# Altium project rgb_card.PrjPcb (part 1 of 4)
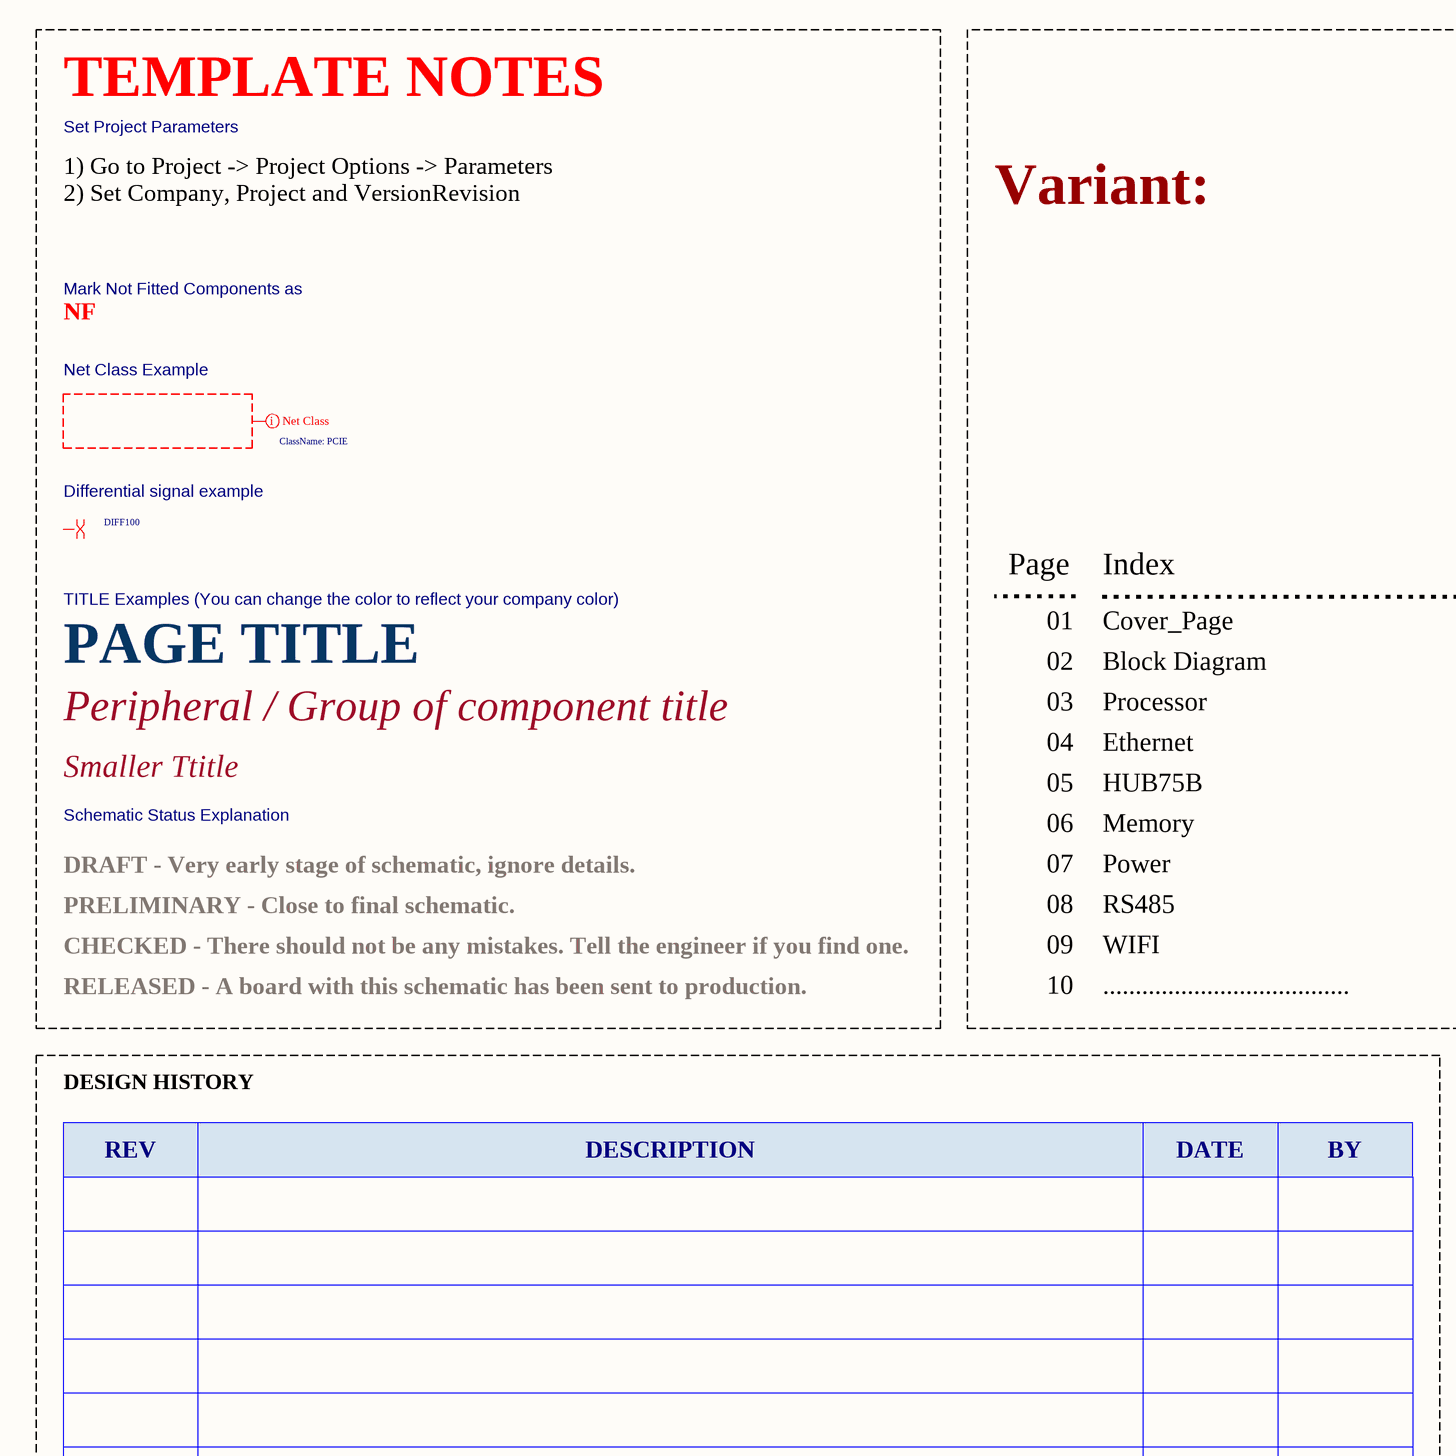
[diagram p0: Cover_Page.SchDoc, left]
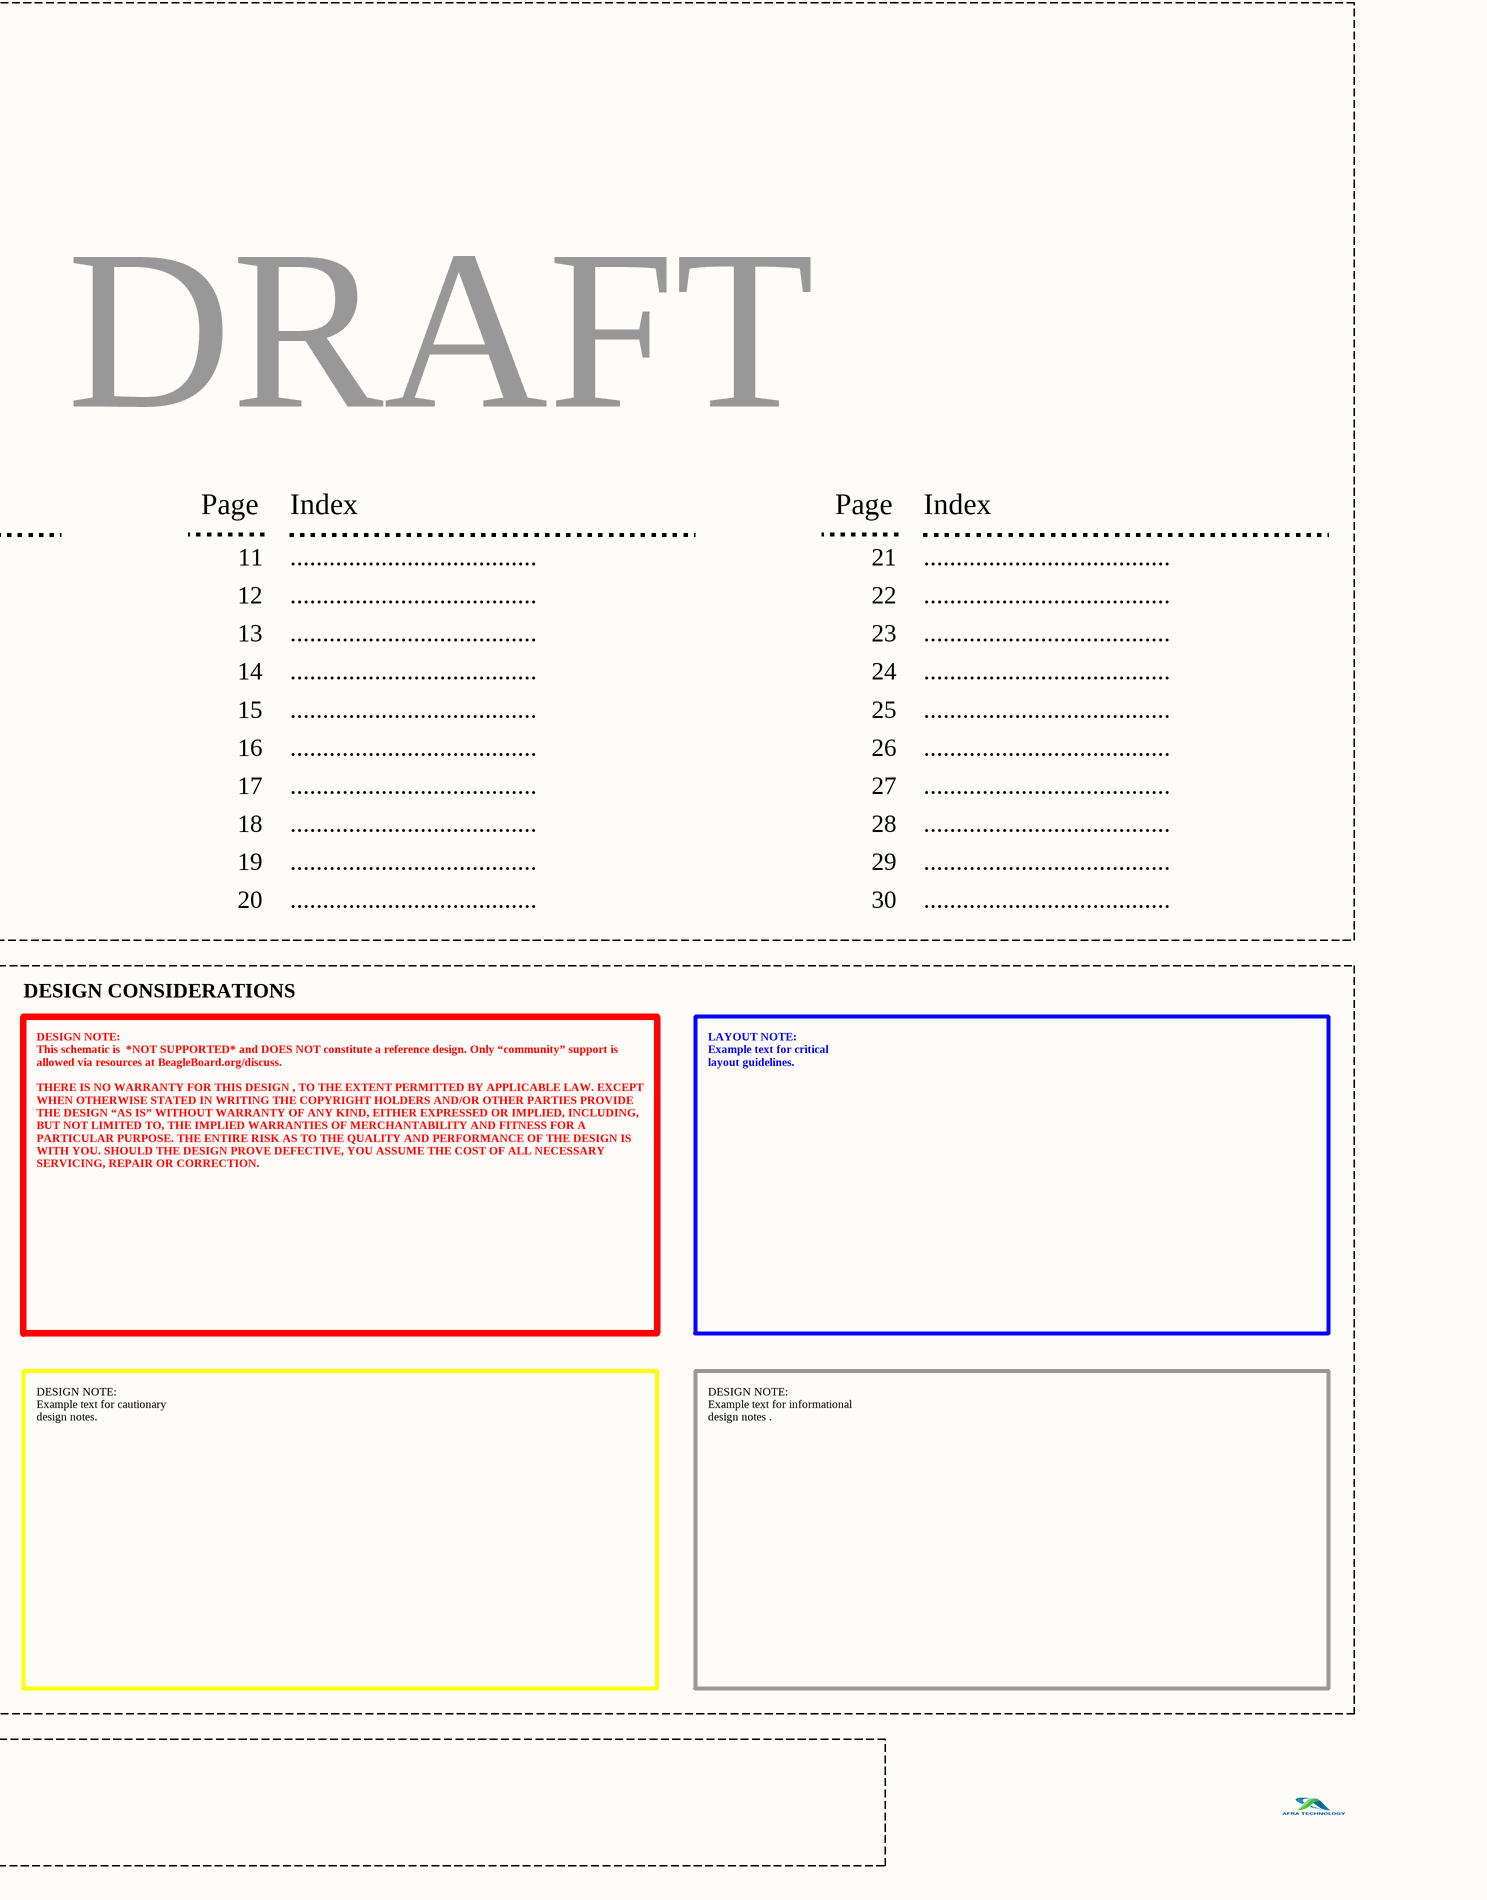
[diagram p1: Cover_Page.SchDoc, right]
Company: AFRA TECHNOLOGY; Project: RGB DMD Card; VersionRevision: v1.0.0
12 sheets, 273 parts. Net scope: hierarchical (ports join the sheet entries above them; power ports are global).
Board file: rgb_card.PcbDoc
Sheets:
  Cover_Page.SchDoc
  Block_Diagram.SchDoc
    U_rgb_card = rgb_card.SchDoc
    U_rs485 = rs485.SchDoc
    U_memory = memory.SchDoc
    U_wifi = wifi.SchDoc
    U_hub75d = hub75d.SchDoc
    U_power = power.SchDoc
    U_phy = phy.SchDoc
    U_rtc = rtc.SchDoc
    U_modem = modem.SchDoc
  ethernet.SchDoc

## Sheet Cover_Page.SchDoc
size A2; DrawnBy: Hanif; DocumentNumber: 202205001; SheetNumber: 1; SheetTotal: 9

### Layout directives
net class PCIE: (no net found under the mark)
differential pair; net class DIFF100: (no net found under the mark)

### Notes on the sheet
- Set Project Parameters
- TEMPLATE NOTES
- Variant:
- 1) Go to Project -> Project Options -> Parameters
  2) Set Company, Project and VersionRevision
- NF
- Mark Not Fitted Components as
- Net Class Example
- Differential signal example
- DRAFT
- TITLE Examples (You can change the color to reflect your company color)
- Page
- Index
- PAGE TITLE
- 01
- 02
- Cover_Page
- Block Diagram
- 11
- 12
- ......................................
- 21
- 22
- Peripheral / Group of component title
- 03
- 04
- Processor
- Ethernet
- 13
- 14
- 23
- 24
- Schematic Status Explanation
- Smaller Ttitle
- 05
- HUB75B
- 15
- 25
- DRAFT - Very early stage of schematic, ignore details.
- 06
- 07
- Memory
- Power
- 16
- 17
- 26
- 27
- PRELIMINARY - Close to final schematic.
- CHECKED - There should not be any mistakes. Tell the engineer if you find one.
- 08
- 09
- RS485
- WIFI
- 18
- 19
- 28
- 29
- RELEASED - A board with this schematic has been sent to production.
- 10
- 20
- 30
- DESIGN HISTORY
- DESIGN CONSIDERATIONS
- REV
- DESCRIPTION
- DATE
- BY
- DESIGN NOTE:
  This schematic is  *NOT SUPPORTED* and DOES NOT constitute a reference design. Only “community” support is allowed via resources at BeagleBoard.org/discuss.
  THERE IS NO WARRANTY FOR THIS DESIGN , TO THE EXTENT PERMITTED BY APPLICABLE LAW. EXCEPT WHEN OTHERWISE STATED IN WRITING THE COPYRIGHT HOLDERS AND/OR OTHER PARTIES PROVIDE THE DESIGN “AS IS” WITHOUT WARRANTY OF ANY KIND, EITHER EXPRESSED OR IMPLIED, INCLUDING, BUT NOT LIMITED TO, THE IMPLIED WARRANTIES OF MERCHANTABILITY AND FITNESS FOR A PARTICULAR PURPOSE. THE ENTIRE RISK AS TO THE QUALITY AND PERFORMANCE OF THE DESIGN IS WITH YOU. SHOULD THE DESIGN PROVE DEFECTIVE, YOU ASSUME THE COST OF ALL NECESSARY SERVICING, REPAIR OR CORRECTION.
- LAYOUT NOTE:
  Example text for critical
  layout guidelines.
- DESIGN NOTE:
  Example text for cautionary
  design notes.
- DESIGN NOTE:
  Example text for informational
  design notes .
- CONFIDENTAL. Do not distribute.
- Page Contents:
- Title:
- Company
- Logo
- Date:
- SIZE:
- A2
- DWG Num:
- Time:
- Sheet
- Revision:
- of
- Drawn by:
- Checked by:

## Sheet Block_Diagram.SchDoc
size A2; SheetNumber: 2; SheetTotal: 9
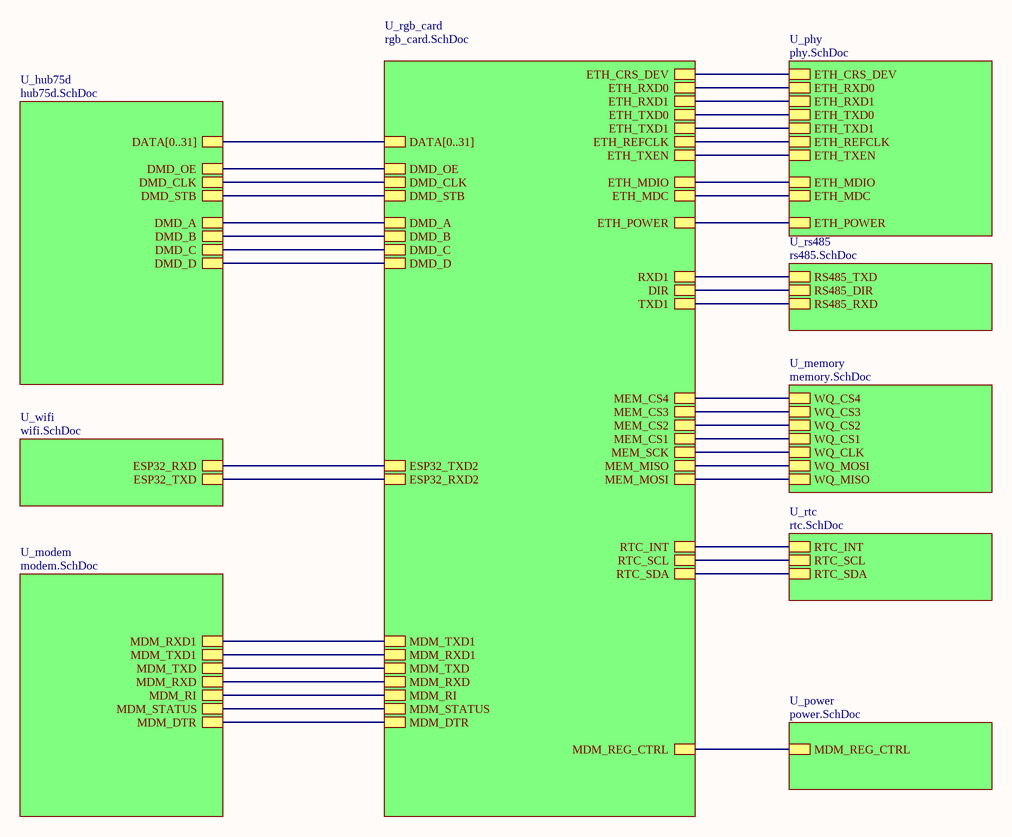
[diagram p2: Block_Diagram.SchDoc]

### Sub-sheets
U_hub75d = hub75d.SchDoc: DATA[0..31], DMD_OE, DMD_B, DMD_STB, DMD_D, DMD_C, DMD_CLK, DMD_A
U_memory = memory.SchDoc: WQ_CS1, WQ_MOSI, WQ_MISO, WQ_CLK, WQ_CS2, WQ_CS3, WQ_CS4
U_modem = modem.SchDoc: MDM_RXD, MDM_RXD1, MDM_RI, MDM_TXD, MDM_TXD1, MDM_STATUS, MDM_DTR
U_phy = phy.SchDoc: ETH_CRS_DEV, ETH_RXD0, ETH_RXD1, ETH_TXD0, ETH_TXD1, ETH_REFCLK, ETH_TXEN, ETH_MDIO, ETH_MDC, ETH_POWER
U_power = power.SchDoc: MDM_REG_CTRL
U_rgb_card = rgb_card.SchDoc: ESP32_TXD2, ESP32_RXD2, TXD1, RXD1, DIR, MEM_CS1, MEM_SCK, MEM_MISO, MEM_MOSI, DMD_D, DMD_OE, DMD_C, DMD_STB, DMD_B, DMD_CLK, DMD_A, DATA[0..31], MEM_CS3, MEM_CS2, MEM_CS4, ETH_TXD0, ETH_CRS_DEV, ETH_TXD1, ETH_REFCLK, ETH_RXD1, ETH_RXD0, ETH_TXEN, ETH_MDIO, ETH_MDC, ETH_POWER, RTC_SDA, RTC_SCL, RTC_INT, MDM_DTR, MDM_STATUS, MDM_TXD, MDM_TXD1, MDM_RXD, MDM_RXD1, MDM_RI, MDM_REG_CTRL
U_rs485 = rs485.SchDoc: RS485_TXD, RS485_DIR, RS485_RXD
U_rtc = rtc.SchDoc: RTC_INT, RTC_SCL, RTC_SDA
U_wifi = wifi.SchDoc: ESP32_RXD, ESP32_TXD

### Nets
DIR: sheet U_rgb_card/DIR, sheet U_rs485/RS485_DIR
DMD_A: sheet U_rgb_card/DMD_A, sheet U_hub75d/DMD_A
DMD_B: sheet U_rgb_card/DMD_B, sheet U_hub75d/DMD_B
DMD_C: sheet U_rgb_card/DMD_C, sheet U_hub75d/DMD_C
DMD_CLK: sheet U_rgb_card/DMD_CLK, sheet U_hub75d/DMD_CLK
DMD_D: sheet U_rgb_card/DMD_D, sheet U_hub75d/DMD_D
DMD_OE: sheet U_rgb_card/DMD_OE, sheet U_hub75d/DMD_OE
DMD_STB: sheet U_rgb_card/DMD_STB, sheet U_hub75d/DMD_STB
ESP32_RXD: sheet U_rgb_card/ESP32_TXD2, sheet U_wifi/ESP32_RXD
ESP32_TXD: sheet U_rgb_card/ESP32_RXD2, sheet U_wifi/ESP32_TXD
ETH_CRS_DEV: sheet U_rgb_card/ETH_CRS_DEV, sheet U_phy/ETH_CRS_DEV
ETH_MDC: sheet U_rgb_card/ETH_MDC, sheet U_phy/ETH_MDC
ETH_MDIO: sheet U_rgb_card/ETH_MDIO, sheet U_phy/ETH_MDIO
ETH_POWER: sheet U_rgb_card/ETH_POWER, sheet U_phy/ETH_POWER
ETH_REF_CLK: sheet U_rgb_card/ETH_REFCLK, sheet U_phy/ETH_REFCLK
ETH_RXD0: sheet U_rgb_card/ETH_RXD0, sheet U_phy/ETH_RXD0
ETH_RXD1: sheet U_rgb_card/ETH_RXD1, sheet U_phy/ETH_RXD1
ETH_TX_EN: sheet U_rgb_card/ETH_TXEN, sheet U_phy/ETH_TXEN
ETH_TXD0: sheet U_rgb_card/ETH_TXD0, sheet U_phy/ETH_TXD0
ETH_TXD1: sheet U_rgb_card/ETH_TXD1, sheet U_phy/ETH_TXD1
MDM_DTR: sheet U_rgb_card/MDM_DTR, sheet U_modem/MDM_DTR
MDM_REG_CTRL: sheet U_rgb_card/MDM_REG_CTRL, sheet U_power/MDM_REG_CTRL
MDM_RI: sheet U_rgb_card/MDM_RI, sheet U_modem/MDM_RI
MDM_RXD: sheet U_rgb_card/MDM_RXD, sheet U_modem/MDM_RXD
MDM_RXD1: sheet U_rgb_card/MDM_TXD1, sheet U_modem/MDM_RXD1
MDM_STATUS: sheet U_rgb_card/MDM_STATUS, sheet U_modem/MDM_STATUS
MDM_TXD: sheet U_rgb_card/MDM_TXD, sheet U_modem/MDM_TXD
MDM_TXD1: sheet U_rgb_card/MDM_RXD1, sheet U_modem/MDM_TXD1
MEM_CS1: sheet U_rgb_card/MEM_CS1, sheet U_memory/WQ_CS1
MEM_CS2: sheet U_rgb_card/MEM_CS2, sheet U_memory/WQ_CS2
MEM_CS3: sheet U_rgb_card/MEM_CS3, sheet U_memory/WQ_CS3
MEM_CS4: sheet U_rgb_card/MEM_CS4, sheet U_memory/WQ_CS4
MEM_MISO: sheet U_rgb_card/MEM_MISO, sheet U_memory/WQ_MOSI
MEM_MOSI: sheet U_rgb_card/MEM_MOSI, sheet U_memory/WQ_MISO
MEM_SCK: sheet U_rgb_card/MEM_SCK, sheet U_memory/WQ_CLK
RS485_RXD: sheet U_rgb_card/TXD1, sheet U_rs485/RS485_RXD
RS485_TXD: sheet U_rgb_card/RXD1, sheet U_rs485/RS485_TXD
RTC_INT: sheet U_rgb_card/RTC_INT, sheet U_rtc/RTC_INT
RTC_SCL: sheet U_rgb_card/RTC_SCL, sheet U_rtc/RTC_SCL
RTC_SDA: sheet U_rgb_card/RTC_SDA, sheet U_rtc/RTC_SDA

### Buses and harness runs
bus sheet U_hub75d/DATA[0..31] = sheet U_rgb_card/DATA[0..31]

### Notes on the sheet
- CONFIDENTAL. Do not distribute.
- Page Contents:
- Title:
- Company
- Logo
- Date:
- SIZE:
- A2
- DWG Num:
- Time:
- Variant:
- Sheet
- Revision:
- of
- Drawn by:
- Checked by:

## Sheet rgb_card.SchDoc
size A3
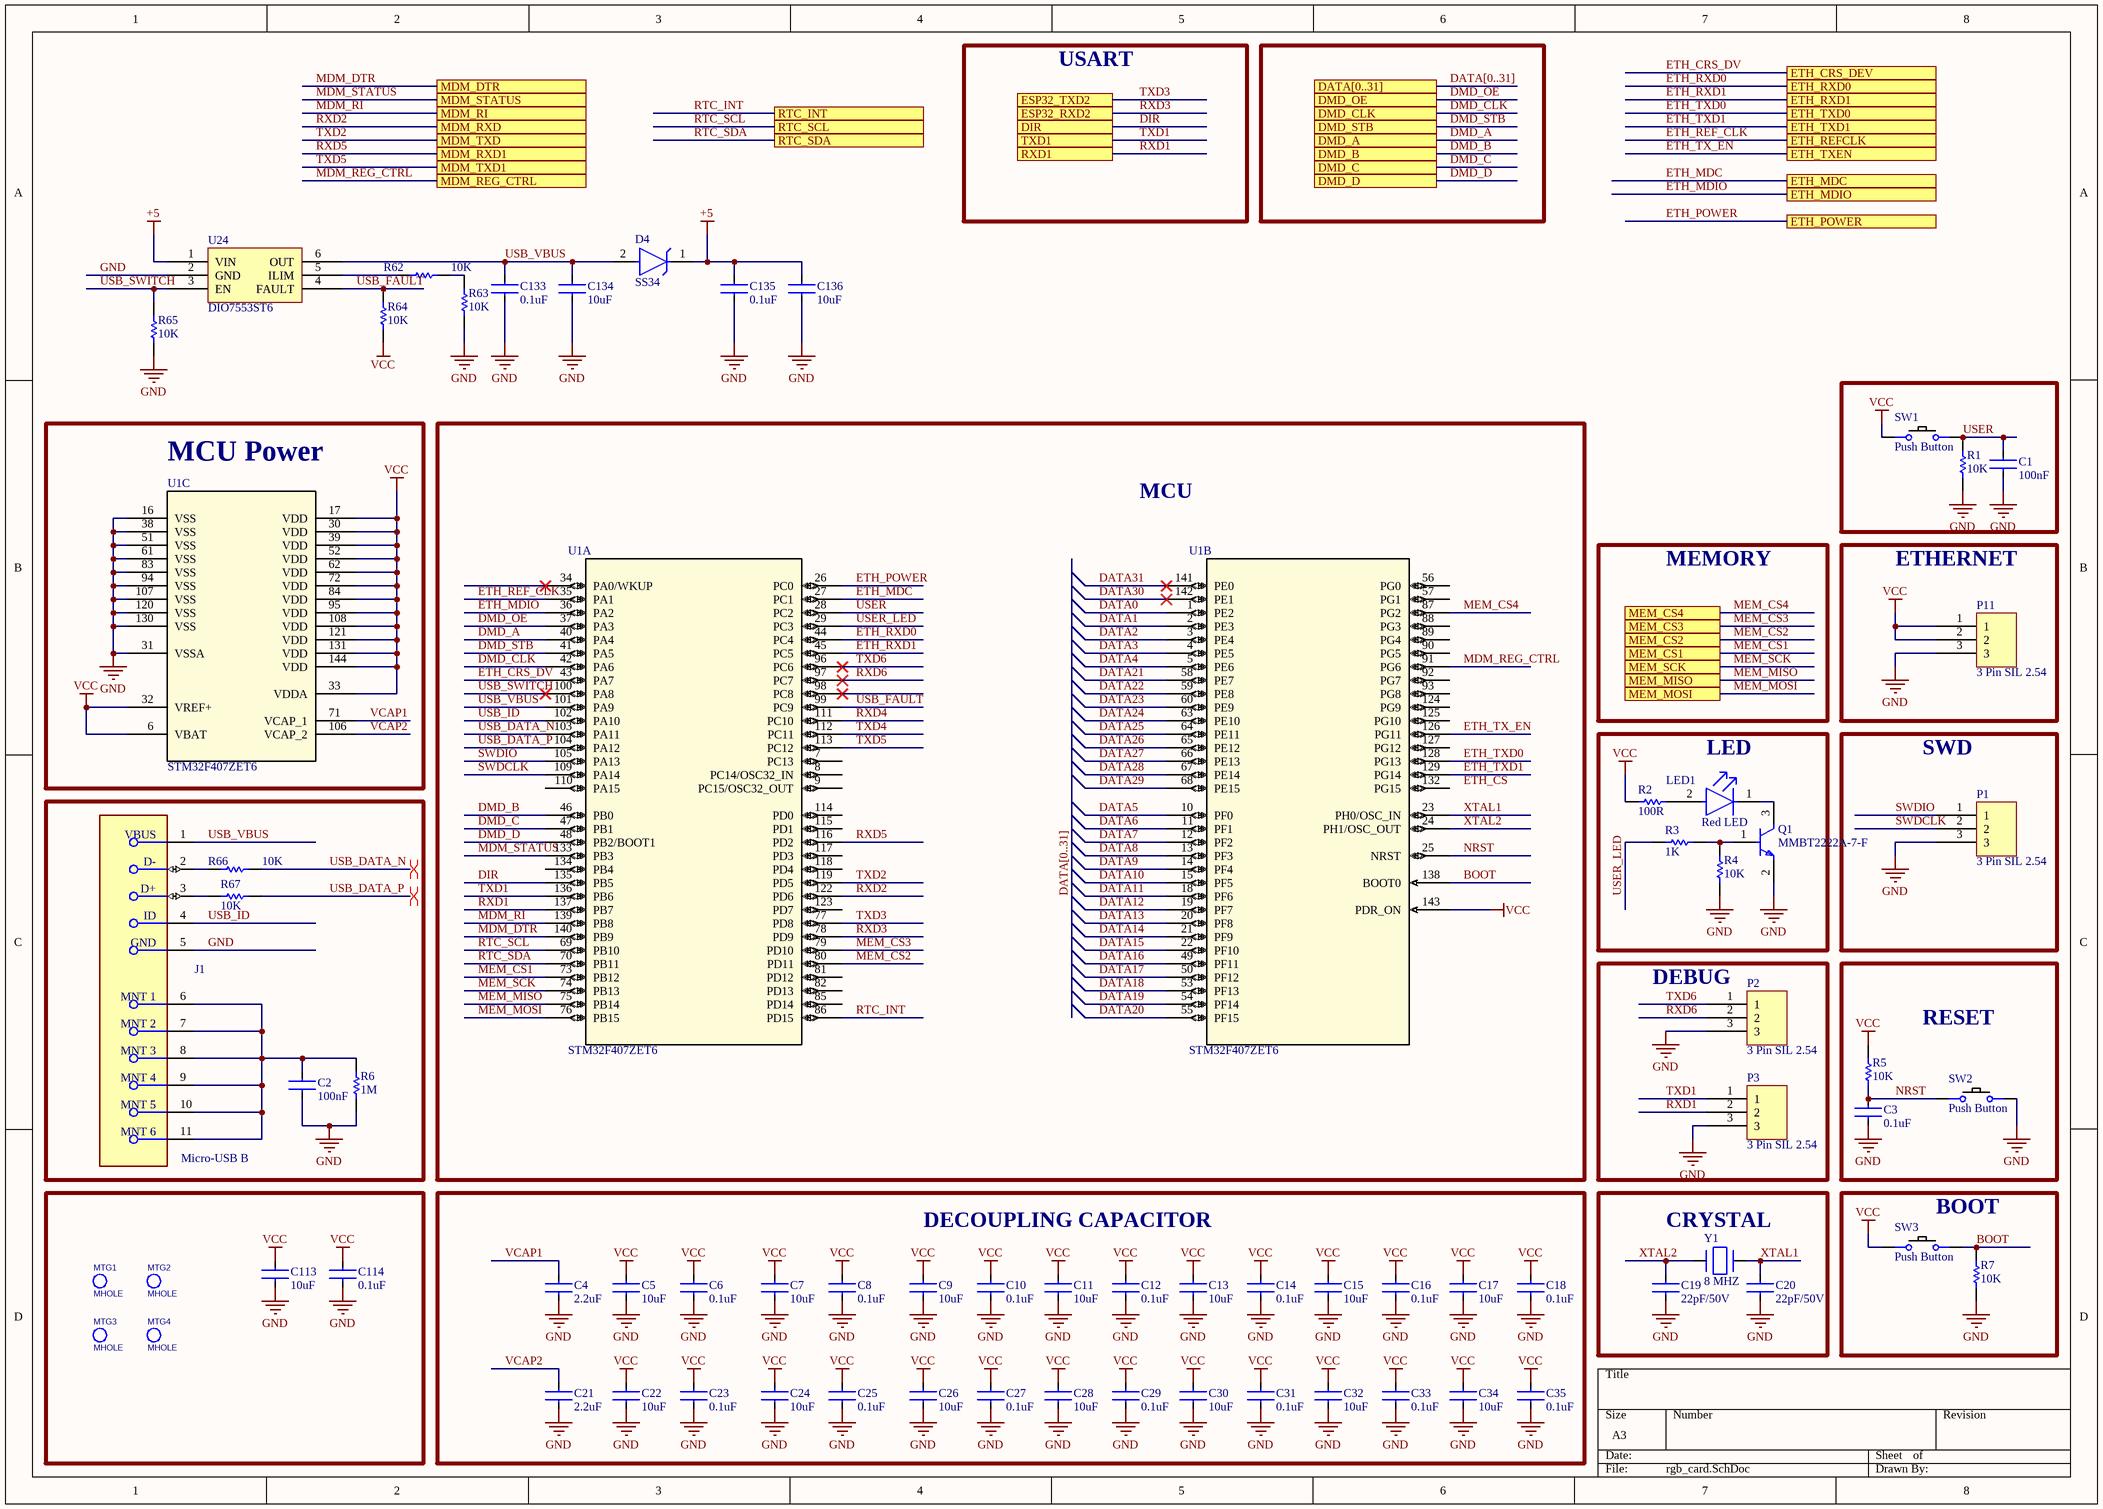
[diagram p3: rgb_card.SchDoc]

### Parts
C1  100nF  [C0402]
C2  100nF  [C0402]
C3  0.1uF  [C0402]
C4  2.2uF  [C0402]
C5  10uF  [C0402]
C6  0.1uF  [C0402]
C7  10uF  [C0402]
C8  0.1uF  [C0402]
C9  10uF  [C0402]
C10  0.1uF  [C0402]
C11  10uF  [C0402]
C12  0.1uF  [C0402]
C13  10uF  [C0402]
C14  0.1uF  [C0402]
C15  10uF  [C0402]
C16  0.1uF  [C0402]
C17  10uF  [C0402]
C18  0.1uF  [C0402]
C19  22pF/50V  [C0402]
C20  22pF/50V  [C0402]
C21  2.2uF  [C0402]
C22  10uF  [C0402]
C23  0.1uF  [C0402]
C24  10uF  [C0402]
C25  0.1uF  [C0402]
C26  10uF  [C0402]
C27  0.1uF  [C0402]
C28  10uF  [C0402]
C29  0.1uF  [C0402]
C30  10uF  [C0402]
C31  0.1uF  [C0402]
C32  10uF  [C0402]
C33  0.1uF  [C0402]
C34  10uF  [C0402]
C35  0.1uF  [C0402]
C113  10uF  [C0402]
C114  0.1uF  [C0402]
C133  0.1uF  [C0402]
C134  10uF  [C0402]
C135  0.1uF  [C0402]
C136  10uF  [C0402]
D4  SS34  [SMA (DO-214AC)]
J1  Micro-USB B  [Micro_USB_47346- 1001]
LED1  Red LED  [SMD_LED_1206]
MTG1  MHOLE  [MHOLE]  (no BOM)
MTG2  MHOLE  [MHOLE]  (no BOM)
MTG3  MHOLE  [MHOLE]  (no BOM)
MTG4  MHOLE  [MHOLE]  (no BOM)
P1  3 Pin SIL 2.54  [3 Pin SIL 2.54]
P2  3 Pin SIL 2.54  [3 Pin SIL 2.54]
P3  3 Pin SIL 2.54  [3 Pin SIL 2.54]
P11  3 Pin SIL 2.54  [3 Pin SIL 2.54]
Q1  MMBT2222A-7-F  [SOT-23-3L_AOS]
R1  10K  [R0402]
R2  100R  [R0402]
R3  1K  [R0402]
R4  10K  [R0402]
R5  10K  [R0402]
R6  1M  [R0402]
R7  10K  [R0402]
R62  10K  [R0402]
R63  10K  [R0402]
R64  10K  [R0402]
R65  10K  [R0402]
R66  10K  [R0402]
R67  10K  [R0402]
SW1  Push Button  [Tactile Switch SPST]
SW2  Push Button  [Tactile Switch SPST]
SW3  Push Button  [Tactile Switch SPST]
U1  STM32F407ZET6  [LQFP144-20x20mm]  (parts A,B,C of 3)
U24  DIO7553ST6  [SOT23-6]
Y1  8 MHZ  [CTS_ATS080B_0]

### Blocks framed on the sheet
MCU Power: U1
MCU: U1
ETHERNET: P11
LED: LED1 Q1 R2-R4
SWD: P1
DEBUG: P2 P3
RESET: C3 R5 SW2
DECOUPLING CAPACITOR: C4-C18 C21-C35
CRYSTAL: C19 C20 Y1
BOOT: R7 SW3

### Ports
DATA[0..31], DIR, DMD_A, DMD_B, DMD_C, DMD_CLK, DMD_D, DMD_OE, DMD_STB, ESP32_RXD2, ESP32_TXD2, ETH_CRS_DEV, ETH_MDC, ETH_MDIO, ETH_POWER, ETH_REFCLK, ETH_RXD0, ETH_RXD1, ETH_TXD0, ETH_TXD1, ETH_TXEN, MDM_DTR, MDM_REG_CTRL, MDM_RI, MDM_RXD, MDM_RXD1, MDM_STATUS, MDM_TXD, MDM_TXD1, MEM_CS1, MEM_CS2, MEM_CS3, MEM_CS4, MEM_MISO, MEM_MOSI, MEM_SCK, RTC_INT, RTC_SCL, RTC_SDA, RXD1, TXD1

### Nets
+5: C135.1 C136.1 D4.1(C) U24.1(VIN)
GND: C1.2 C2.2 C3.2 C4.2 C5.2 C6.2 C7.2 C8.2 C9.2 C10.2 C11.2 C12.2 C13.2 C14.2 C15.2 C16.2 C17.2 C18.2 C19.2 C20.2 C21.2 C22.2 C23.2 C24.2 C25.2 C26.2 C27.2 C28.2 C29.2 C30.2 C31.2 C32.2 C33.2 C34.2 C35.2 C113.2 C114.2 C133.2 C134.2 C135.2 C136.2 J1.5(GND) P1.3 P2.3 P3.3 P11.3 Q1.2(E) R1.1 R4.1 R6.1 R7.1 R63.1 R65.1 SW2.3,4 U1.16(VSS) U1.31(VSSA) U1.38(VSS) U1.51(VSS) U1.61(VSS) U1.83(VSS) U1.94(VSS) U1.107(VSS) U1.120(VSS) U1.130(VSS) U24.2(GND)
VCC: C5.1 C6.1 C7.1 C8.1 C9.1 C10.1 C11.1 C12.1 C13.1 C14.1 C15.1 C16.1 C17.1 C18.1 C22.1 C23.1 C24.1 C25.1 C26.1 C27.1 C28.1 C29.1 C30.1 C31.1 C32.1 C33.1 C34.1 C35.1 C113.1 C114.1 P11.1 P11.2 R2.1 R5.2 R64.1 SW1.1,2 SW3.1,2 U1.6(VBAT) U1.17(VDD) U1.30(VDD) U1.32(VREF+) U1.33(VDDA) U1.39(VDD) U1.52(VDD) U1.62(VDD) U1.72(VDD) U1.84(VDD) U1.95(VDD) U1.108(VDD) U1.121(VDD) U1.131(VDD) U1.143(PDR_ON) U1.144(VDD)
BOOT: R7.2 SW3.3,4 U1.138(BOOT0)
DATA0: U1.1(PE2)
DATA1: U1.2(PE3)
DATA2: U1.3(PE4)
DATA3: U1.4(PE5)
DATA4: U1.5(PE6)
DATA5: U1.10(PF0)
DATA6: U1.11(PF1)
DATA7: U1.12(PF2)
DATA8: U1.13(PF3)
DATA9: U1.14(PF4)
DATA10: U1.15(PF5)
DATA11: U1.18(PF6)
DATA12: U1.19(PF7)
DATA13: U1.20(PF8)
DATA14: U1.21(PF9)
DATA15: U1.22(PF10)
DATA16: U1.49(PF11)
DATA17: U1.50(PF12)
DATA18: U1.53(PF13)
DATA19: U1.54(PF14)
DATA20: U1.55(PF15)
DATA21: U1.58(PE7)
DATA22: U1.59(PE8)
DATA23: U1.60(PE9)
DATA24: U1.63(PE10)
DATA25: U1.64(PE11)
DATA26: U1.65(PE12)
DATA27: U1.66(PE13)
DATA28: U1.67(PE14)
DATA29: U1.68(PE15)
DATA30: U1.142(PE1)
DATA31: U1.141(PE0)
DIR: U1.135(PB5) ; port DIR
DMD_A: U1.40(PA4) ; port DMD_A
DMD_B: U1.46(PB0) ; port DMD_B
DMD_C: U1.47(PB1) ; port DMD_C
DMD_CLK: U1.42(PA6) ; port DMD_CLK
DMD_D: U1.48(PB2/BOOT1) ; port DMD_D
DMD_OE: U1.37(PA3) ; port DMD_OE
DMD_STB: U1.41(PA5) ; port DMD_STB
ETH_CRS_DV: U1.43(PA7) ; port ETH_CRS_DEV  [project net ETH_CRS_DEV]
ETH_MDC: U1.27(PC1) ; port ETH_MDC
ETH_MDIO: U1.36(PA2) ; port ETH_MDIO
ETH_POWER: U1.26(PC0) ; port ETH_POWER
ETH_REF_CLK: U1.35(PA1) ; port ETH_REFCLK
ETH_RXD0: U1.44(PC4) ; port ETH_RXD0
ETH_RXD1: U1.45(PC5) ; port ETH_RXD1
ETH_TX_EN: U1.126(PG11) ; port ETH_TXEN
ETH_TXD0: U1.128(PG13) ; port ETH_TXD0
ETH_TXD1: U1.129(PG14) ; port ETH_TXD1
MDM_DTR: U1.140(PB9) ; port MDM_DTR
MDM_REG_CTRL: U1.91(PG6) ; port MDM_REG_CTRL
MDM_RI: U1.139(PB8) ; port MDM_RI
MDM_STATUS: U1.133(PB3) ; port MDM_STATUS
MEM_CS1: U1.73(PB12) ; port MEM_CS1
MEM_CS2: U1.80(PD11) ; port MEM_CS2
MEM_CS3: U1.79(PD10) ; port MEM_CS3
MEM_CS4: U1.87(PG2) ; port MEM_CS4
MEM_MISO: U1.75(PB14) ; port MEM_MISO
MEM_MOSI: U1.76(PB15) ; port MEM_MOSI
MEM_SCK: U1.74(PB13) ; port MEM_SCK
NRST: C3.1 R5.1 SW2.1,2 U1.25(NRST)
RTC_INT: U1.86(PD15) ; port RTC_INT
RTC_SCL: U1.69(PB10) ; port RTC_SCL
RTC_SDA: U1.70(PB11) ; port RTC_SDA
RXD1: P3.2 U1.137(PB7) ; port RXD1  [project net RS485_TXD]
RXD2: U1.122(PD6) ; port MDM_RXD  [project net MDM_RXD]
RXD3: U1.78(PD9) ; port ESP32_RXD2  [project net ESP32_TXD]
RXD4: U1.111(PC10)
RXD5: U1.116(PD2) ; port MDM_RXD1  [project net MDM_TXD1]
RXD6: P2.2 U1.97(PC7)
SWDCLK: P1.2 U1.109(PA14)
SWDIO: P1.1 U1.105(PA13)
TXD1: P3.1 U1.136(PB6) ; port TXD1  [project net RS485_RXD]
TXD2: U1.119(PD5) ; port MDM_TXD  [project net MDM_TXD]
TXD3: U1.77(PD8) ; port ESP32_TXD2  [project net ESP32_RXD]
TXD4: U1.112(PC11)
TXD5: U1.113(PC12) ; port MDM_TXD1  [project net MDM_RXD1]
TXD6: P2.1 U1.96(PC6)
USB_DATA_N: R66.2 U1.103(PA11)
USB_DATA_P: R67.2 U1.104(PA12)
USB_FAULT: R64.2 U1.99(PC9) U24.4(FAULT)
USB_ID: J1.4(ID) U1.102(PA10)
USB_SWITCH: R65.2 U1.100(PA8) U24.3(EN)
USB_VBUS: C133.1 C134.1 D4.2(A) J1.1(VBUS) U1.101(PA9) U24.6(OUT)
USER: C1.1 R1.2 SW1.3,4 U1.28(PC2)
USER_LED: R3.1 U1.29(PC3)
VCAP1: C4.1 U1.71(VCAP_1)
VCAP2: C21.1 U1.106(VCAP_2)
XTAL1: C20.1 U1.23(PH0/OSC_IN) Y1.2
XTAL2: C19.1 U1.24(PH1/OSC_OUT) Y1.1
NetC2_1: C2.1 J1.6(MNT_1) J1.7(MNT_2) J1.8(MNT_3) J1.9(MNT_4) J1.10(MNT_5) J1.11(MNT_6) R6.2
NetJ1_2: J1.2(D-) R66.1
NetJ1_3: J1.3(D+) R67.1
NetLED1_1: LED1.1(C) Q1.3(C)
NetLED1_2: LED1.2(A) R2.2
NetQ1_1: Q1.1(B) R3.2 R4.2
NetR62_1: R62.1 U24.5(ILIM)
NetR62_2: R62.2 R63.2

Not connected (* = marked no-connect by the designer): MTG1 1(TP); MTG2 1(TP); MTG3 1(TP); MTG4 1(TP); U1 7(PC13) 8(PC14/OSC32_IN) 9(PC15/OSC32_OUT) 34(PA0/WKUP)* 56(PG0) 57(PG1) 81(PD12) 82(PD13) 85(PD14) 88(PG3) 89(PG4) 90(PG5) 92(PG7) 93(PG8) 98(PC8)* 110(PA15) 114(PD0) 115(PD1) 117(PD3) 118(PD4) 123(PD7) 124(PG9) 125(PG10) 127(PG12) 132(PG15) 134(PB4)

### Buses and harness runs
bus DATA[0..31]
bus DATA[0..31] = port DATA[0..31]

### Layout directives
differential pair: USB_DATA_N, USB_DATA_P

### Notes on the sheet
- USART
- MEMORY
- Labels drawn without touching a wire or pin: ETH_CS

### Library data of the parts
C1 C2 = CL31B104KBCNFNC: CAP CER 0.1UF 50V X7R 1206, ±10% 50V Ceramic Capacitor X7R 1206 (3216 Metric); Supplier 1: Digi-Key; Supplier Part Number 1: 1276-2744-1-ND
C3 C6 C8 C10 C12 C14 C16 C18 C23 C25 C27 C29 C31 C33 C35 C114 C133 C135 = CL31B104KBCNNNC: Ceramic capacitor SMD-1206 100nF /50V X7R# K +-10%, Samsung, RoHS; Tolerance: 10%; Dielectric: X7R; Voltage: 50V; Supplier 1: Arrow Electronics; Manufacturer: Samsung; Manufacturer Part Number: CL31B104KBCNNNC; RoHS: Yes; Category: Ceramic Capacitors; Stock 1: 3508000; Pricing 1: 4000=0.02060, 8000=0.01660 (USD); Mount: Surface Mount; Case/Package: 1206; Case Code (Metric): 3216; Case Code (Imperial): 1206; Material: Ceramic; Contact Plating: Tin; Min Operating Temperature: -55°C; Max Operating Temperature: 125°C; Capacitance: 100nF; Voltage Rating (DC): 50V; Packaging: Tape and Reel; Voltage Rating: 50V; Series: CL; Length: 3.2mm; Width: 0.063inch; Height: 0.85mm; Depth: 1.6mm; Thickness: 0.037inch; Radiation Hardening: No; Lead Free: Lead Free; RoHS Compliant: Yes; ComponentLink1URL: https://datasheet.ciiva.com/25710/cl31b104kbcnnnc-25710293.pdf?src-supplier=Digi-Key; ComponentLink1Description: https://datasheet.ciiva.com/25710/cl31b104kbcnnnc-25710293.pdf?src-supplier=Digi-Key; ComponentLink2URL: https://datasheet.ciiva.com/29201/451941-da-01-en-vs-kondensator-1206-29201689.pdf?src-supplier=Conrad; ComponentLink2Description: https://datasheet.ciiva.com/29201/451941-da-01-en-vs-kondensator-1206-29201689.pdf?src-supplier=Conrad; ComponentLink3URL: https://datasheet.ciiva.com/16298/cl05b104kq5nnnc-16298186.pdf?src-supplier=Future+Electronics; ComponentLink3Description: https://datasheet.ciiva.com/16298/cl05b104kq5nnnc-16298186.pdf?src-supplier=Future+Electronics; Supplier Part Number 1: CL31B104KBCNNNC
C4 C21 = CL31B225KBHNNNE: Cap Ceramic 2.2uF 50V C0G 5% SMD 1206 125°C Paper T/R; Manufacturer: Samsung; Manufacturer Part Number: CL31C220JBCNNNC; Capacitance: 22pF; Temperature Coefficient: 300ppm/°C; Supplier 1: Arrow Electronics; RoHS: Yes; Category: Ceramic Capacitors; Stock 1: 470; Pricing 1: 1=0.13340, 10=0.08580, 25=0.08490, 100=0.04720, 250=0.04670 (USD); Mount: Surface Mount; Case/Package: 1206; Case Code (Metric): 3216; Case Code (Imperial): 1206; Material: Ceramic; Min Operating Temperature: -55°C; Max Operating Temperature: 125°C; Tolerance: 5%; Dielectric: C0G; Voltage Rating: 50V; Package Quantity: 1; Packaging: Tape and Reel; Voltage: 50V; Voltage Rating (DC): 50V; Series: CL; Construction: Flat; Length: 3.2mm; Width: 0.063inch; Height: 0.85mm; Depth: 1.6mm; Thickness: 0.039inch; Radiation Hardening: No; Lead Free: Lead Free; RoHS Compliant: Yes; ComponentLink1URL: https://datasheet.ciiva.com/25799/cl31c220jbcnnnc-25799089.pdf?src-supplier=Digi-Key; ComponentLink1Description: https://datasheet.ciiva.com/25799/cl31c220jbcnnnc-25799089.pdf?src-supplier=Digi-Key; ComponentLink2URL: https://datasheet.ciiva.com/29201/452314-da-01-en-vs-kondensator-1206-29201377.pdf?src-supplier=Conrad; ComponentLink2Description: https://datasheet.ciiva.com/29201/452314-da-01-en-vs-kondensator-1206-29201377.pdf?src-supplier=Conrad; Supplier Part Number 1: CL31C220JBCNNNC
C5 C7 C9 C11 C13 C15 C17 C22 C24 C26 C28 C30 C32 C34 C113 C134 C136 = CL31B106KOHNNNE: Cap Ceramic 10uF 16V X7R 10% Pad SMD 1206 125°C T/R; Manufacturer: Samsung; Supplier 1: Future Electronics; Manufacturer Part Number: CL31B106KOHNNNE; RoHS: Yes; Category: Ceramic Capacitors; Stock 1: 116000; Pricing 1: 2000=0.03800, 6000=0.03460, 8000=0.03450, 20000=0.03420, 30000=0.03400 (USD); Mount: Surface Mount; Case/Package: 1206; Case Code (Metric): 3216; Case Code (Imperial): 1206; Material: Ceramic; Contact Plating: Tin; Min Operating Temperature: -55°C; Max Operating Temperature: 125°C; Capacitance: 10uF; Tolerance: 10%; Dielectric: X7R; Package Quantity: 1; Packaging: Tape and Reel; Voltage Rating: 16V; Series: CL; Length: 3.2mm; Width: 0.063inch; Height: 1.6mm; Thickness: 0.071inch; Depth: 1.6mm; RoHS Compliant: Yes; ComponentLink1URL: https://datasheet.ciiva.com/25795/cl31b106kohnnne-25795201.pdf?src-supplier=Digi-Key; ComponentLink1Description: https://datasheet.ciiva.com/25795/cl31b106kohnnne-25795201.pdf?src-supplier=Digi-Key; ComponentLink2URL: https://datasheet.ciiva.com/29201/452535-da-01-en-vs-kondensator-1206-29201132.pdf?src-supplier=Conrad; ComponentLink2Description: https://datasheet.ciiva.com/29201/452535-da-01-en-vs-kondensator-1206-29201132.pdf?src-supplier=Conrad; Supplier Part Number 1: 2558872
C19 C20 = CL31C220JBCNNNC: Cap Ceramic 22pF 50V C0G 5% SMD 1206 125°C Paper T/R; Manufacturer: Samsung; Temperature Coefficient: 300ppm/°C; Supplier 1: Arrow Electronics; Manufacturer Part Number: CL31C220JBCNNNC; RoHS: Yes; Category: Ceramic Capacitors; Stock 1: 470; Pricing 1: 1=0.13340, 10=0.08580, 25=0.08490, 100=0.04720, 250=0.04670 (USD); Mount: Surface Mount; Case/Package: 1206; Case Code (Metric): 3216; Case Code (Imperial): 1206; Material: Ceramic; Min Operating Temperature: -55°C; Max Operating Temperature: 125°C; Capacitance: 22pF; Tolerance: 5%; Dielectric: C0G; Voltage Rating: 50V; Package Quantity: 1; Packaging: Tape and Reel; Voltage: 50V; Voltage Rating (DC): 50V; Series: CL; Construction: Flat; Length: 3.2mm; Width: 0.063inch; Height: 0.85mm; Depth: 1.6mm; Thickness: 0.039inch; Radiation Hardening: No; Lead Free: Lead Free; RoHS Compliant: Yes; ComponentLink1URL: https://datasheet.ciiva.com/25799/cl31c220jbcnnnc-25799089.pdf?src-supplier=Digi-Key; ComponentLink1Description: https://datasheet.ciiva.com/25799/cl31c220jbcnnnc-25799089.pdf?src-supplier=Digi-Key; ComponentLink2URL: https://datasheet.ciiva.com/29201/452314-da-01-en-vs-kondensator-1206-29201377.pdf?src-supplier=Conrad; ComponentLink2Description: https://datasheet.ciiva.com/29201/452314-da-01-en-vs-kondensator-1206-29201377.pdf?src-supplier=Conrad; Supplier Part Number 1: CL31C220JBCNNNC
D4 = SS34: DIODE SCHOTTKY 40V 3A SMC; Supplier 1: Newark; Supplier Part Number 1: 05R5898
J1 = 47346-0001: Micro-USB B Receptacle with Flange, Bottom Mount, Surface Mount, Lead-Free; Manufacturer: Molex; Supplier 1: Arrow Electronics; Manufacturer Part Number: 47346-0001; RoHS: Yes; Category: Headers and Wire Housings; Stock 1: 5771; Pricing 1: 1=1.09160, 10=0.90940, 25=0.90030, 100=0.76040, 250=0.75290, 500=0.74530, 1000=0.57460, 3000=0.56860, 6000=0.56250 (USD); ComponentLink1URL: https://datasheet.ciiva.com/30075/304740473460001-io-nectors-30075527.pdf?src-supplier=Onlinecomponents.com; ComponentLink1Description: https://datasheet.ciiva.com/30075/304740473460001-io-nectors-30075527.pdf?src-supplier=Onlinecomponents.com; ComponentLink2URL: https://datasheet.ciiva.com/16148/1700180473460001-io-nectors-16148917.pdf?src-supplier=Onlinecomponents.com; ComponentLink2Description: https://datasheet.ciiva.com/16148/1700180473460001-io-nectors-16148917.pdf?src-supplier=Onlinecomponents.com; ComponentLink3URL: https://datasheet.ciiva.com/22654/1630785-22654942.pdf?src-supplier=Element14; ComponentLink3Description: https://datasheet.ciiva.com/22654/1630785-22654942.pdf?src-supplier=Element14; ComponentLink4URL: https://datasheet.ciiva.com/4598/0473460001-io-connectors-146446-4598841.pdf?src-supplier=Mouser; ComponentLink4Description: https://datasheet.ciiva.com/4598/0473460001-io-connectors-146446-4598841.pdf?src-supplier=Mouser; ComponentLink5URL: https://datasheet.ciiva.com/1098/1698067-1098476.pdf?src-supplier=Element14; ComponentLink5Description: https://datasheet.ciiva.com/1098/1698067-1098476.pdf?src-supplier=Element14; ComponentLink6URL: https://datasheet.ciiva.com/11731/0900766b80dfe0a7-11731298.pdf?src-supplier=RSComponents; ComponentLink6Description: https://datasheet.ciiva.com/11731/0900766b80dfe0a7-11731298.pdf?src-supplier=RSComponents; ComponentLink7URL: https://datasheet.ciiva.com/16986/70266948-16986683.pdf?src-supplier=Allied+Electronics; ComponentLink7Description: https://datasheet.ciiva.com/16986/70266948-16986683.pdf?src-supplier=Allied+Electronics; ComponentLink8URL: https://datasheet.ciiva.com/28504/0473460001-io-connectors-28504587.pdf?src-supplier=Element14; ComponentLink8Description: https://datasheet.ciiva.com/28504/0473460001-io-connectors-28504587.pdf?src-supplier=Element14; ComponentLink9URL: https://datasheet.ciiva.com/46390/1681853-46390956.pdf?src-supplier=Element14; ComponentLink9Description: https://datasheet.ciiva.com/46390/1681853-46390956.pdf?src-supplier=Element14; Supplier Part Number 1: 47346-0001
LED1 = LTST-C150CKT: Red 3.2 x 1.6 x 1.1 mm 130° Water Clear 10 mcd 1.8 V Chip LED Surface Mount; Manufacturer: Vishay Lite-On; Lens Color: Colorless; Lens Style: Diffused,Colorless,Clear,Rectangular; Dominant Wavelength: 638nm; Number of LEDs: 1; Forward Current: 40mA; Forward Voltage: 1.8V; Power Rating: 100mW; Luminous Intensity: 25mcd; Test Current: 10mA; Wavelength: 660nm; Reverse Voltage: 5V; Supplier 1: IBE SMT Equipment; Manufacturer Part Number: LTST-C150CKT; RoHS: Yes; Category: LEDs; Stock 1: 5225; Pricing 1: 5225=0.05000 (USD); Mount: Surface Mount; Case/Package: 1206; Number of Pins: 2; Color: Red; Case Code (Metric): 3216; Case Code (Imperial): 1206; Min Operating Temperature: -55°C; Max Operating Temperature: 85°C; Viewing Angle: 130°; Packaging: Tape and Reel; Package Quantity: 1; Illumination Color: Red; Lens Transparency: Clear; Number of Elements: 1; Power Dissipation: 100mW; Series: CHIPLED 1206; Max Power Dissipation: 100mW; Length: 3.2mm; Width: 1.6mm; Height: 1.1mm; Depth: 1.6mm; Radiation Hardening: No; Lead Free: Lead Free; RoHS Compliant: Yes; ComponentLink1URL: https://datasheet.ciiva.com/2110/ltst-c150ckt-2110225.pdf?src-supplier=Digi-Key; ComponentLink1Description: https://datasheet.ciiva.com/2110/ltst-c150ckt-2110225.pdf?src-supplier=Digi-Key; ComponentLink2URL: https://datasheet.ciiva.com/11775/0900766b80dc025c-11775635.pdf?src-supplier=RSComponents; ComponentLink2Description: https://datasheet.ciiva.com/11775/0900766b80dc025c-11775635.pdf?src-supplier=RSComponents; ComponentLink3URL: https://datasheet.ciiva.com/19465/697733-19465844.pdf?src-supplier=Jameco; ComponentLink3Description: https://datasheet.ciiva.com/19465/697733-19465844.pdf?src-supplier=Jameco; ComponentLink4URL: https://datasheet.ciiva.com/16222/lite-on20ltst-c150ckt-16222610.pdf?src-supplier=Future+Electronics; ComponentLink4Description: https://datasheet.ciiva.com/16222/lite-on20ltst-c150ckt-16222610.pdf?src-supplier=Future+Electronics; ComponentLink5URL: https://datasheet.ciiva.com/15117/getdatasheetpartid-103928-15117444.pdf?src-supplier=Verical; ComponentLink5Description: https://datasheet.ciiva.com/15117/getdatasheetpartid-103928-15117444.pdf?src-supplier=Verical; ComponentLink6URL: https://datasheet.ciiva.com/2110/s-110-ltst-c150ckt-2110226.pdf?src-supplier=Digi-Key; ComponentLink6Description: https://datasheet.ciiva.com/2110/s-110-ltst-c150ckt-2110226.pdf?src-supplier=Digi-Key; ComponentLink7URL: https://datasheet.ciiva.com/2110/s-110-ltst-c150ckt-2110227.pdf?src-supplier=Digi-Key; ComponentLink7Description: https://datasheet.ciiva.com/2110/s-110-ltst-c150ckt-2110227.pdf?src-supplier=Digi-Key; Supplier Part Number 1: LTST-C150CKT
Q1 = MMBT2222A-7-F: NPN Ic=600mA Vceo=40V hfe=100~300 fT=300MHz P=310mW SOT-23; Manufacturer: Diodes; hFE Min: 100; Frequency: 300MHz; Max Power Dissipation: 300mW; Number of Elements: 1; Collector Emitter Voltage (VCEO): 40V; Collector Base Voltage (VCBO): 75V; Emitter Base Voltage (VEBO): 6V; Collector Emitter Saturation Voltage: 1V; Max Collector Current: 600mA; Power Dissipation: 350mW; Element Configuration: Single; Current: 1A; Supplier 1: RSComponents; Manufacturer Part Number: MMBT2222A-7-F; RoHS: Yes; Category: BJTs; Stock 1: 3000; Pricing 1: 3000=0.02700, 6000=0.02500, 12000=0.02400, 30000=0.02300, 60000=0.02100 (USD); Mount: Surface Mount; Case/Package: SOT-23; Number of Pins: 3; Weight: 0.000282oz; Contact Plating: Tin,Matte; Min Operating Temperature: -55°C; Max Operating Temperature: 150°C; Polarity: NPN; Packaging: Tape and Reel; Package Quantity: 3000; Continuous Collector Current: 600mA; Collector Emitter Breakdown Voltage: 40V; Transition Frequency: 300MHz; Max Breakdown Voltage: 40V; Max Frequency: 300MHz; Termination: SMD/SMT; Gain Bandwidth Product: 300MHz; Voltage Rating (DC): 40V; Current Rating: 600mA; Voltage: 40V; Collector-emitter Voltage-Max: 1V; Series: -; Length: 3.05mm; Width: 1.4mm; Height: 1mm; Radiation Hardening: No; REACH SVHC: No SVHC; Lead Free: Lead Free; RoHS Compliant: Yes; ComponentLink1URL: https://datasheet.ciiva.com/15139/getdatasheetpartid-82692-15139078.pdf?src-supplier=Verical; ComponentLink1Description: https://datasheet.ciiva.com/15139/getdatasheetpartid-82692-15139078.pdf?src-supplier=Verical; ComponentLink2URL: https://datasheet.ciiva.com/8029/ds30041-8029709.pdf?src-supplier=Element14; ComponentLink2Description: https://datasheet.ciiva.com/8029/ds30041-8029709.pdf?src-supplier=Element14; ComponentLink3URL: https://datasheet.ciiva.com/11201/ds30041-11201864.pdf?src-supplier=Avnet; ComponentLink3Description: https://datasheet.ciiva.com/11201/ds30041-11201864.pdf?src-supplier=Avnet; ComponentLink4URL: https://datasheet.ciiva.com/16199/ds30041-16199045.pdf?src-supplier=Future+Electronics; ComponentLink4Description: https://datasheet.ciiva.com/16199/ds30041-16199045.pdf?src-supplier=Future+Electronics; ComponentLink5URL: https://datasheet.ciiva.com/11198/ds30041-11198965.pdf?src-supplier=Avnet; ComponentLink5Description: https://datasheet.ciiva.com/11198/ds30041-11198965.pdf?src-supplier=Avnet; ComponentLink6URL: https://datasheet.ciiva.com/972/ds30041-972551.pdf?src-supplier=Digi-Key; ComponentLink6Description: https://datasheet.ciiva.com/972/ds30041-972551.pdf?src-supplier=Digi-Key; ComponentLink7URL: https://datasheet.ciiva.com/972/ds30041-972552.pdf?src-supplier=Digi-Key; ComponentLink7Description: https://datasheet.ciiva.com/972/ds30041-972552.pdf?src-supplier=Digi-Key; ComponentLink8URL: https://datasheet.ciiva.com/972/ds30041-972550.pdf?src-supplier=Digi-Key; ComponentLink8Description: https://datasheet.ciiva.com/972/ds30041-972550.pdf?src-supplier=Digi-Key; Supplier Part Number 1: 1219442
R1 R4 R5 R7 R62-R67 = RC1206FR-0710KL: Res Thick Film 1206 10K Ohm 1% 0.25W(1/4W) ±100ppm/C Pad SMD T/R; Manufacturer: Yageo; Resistance: 10kR; Temperature Coefficient: 100ppm/°C; Power Rating: 250mW; Voltage Rating: 200V; Supplier 1: Arrow Electronics; Manufacturer Part Number: RC1206FR-0710KL; RoHS: Yes; Category: Chip SMD Resistors; Stock 1: 10000; Pricing 1: 5000=0.00970 (USD); Case/Package: 1206; Case Code (Imperial): 1206; Case Code (Metric): 3216; Size Code: 1206; Min Operating Temperature: -55°C; Max Operating Temperature: 155°C; Tolerance: 1%; Packaging: Tape and Reel; Resistor Type: Thick Film; Package Quantity: 5000; Termination: SMD/SMT; Features: Moisture Resistant; Series: RC; Max Power Dissipation: 250mW; Number of Terminations: 2; Resistance Tolerance: 1%; Construction: Rectangular; Length: 3.1mm; Width: 1.6mm; Height: 0.55mm; Depth: 1.6mm; REACH SVHC: Unknown; Lead Free: Lead Free; Military Standard: Not; RoHS Compliant: Yes; ComponentLink1URL: https://datasheet.ciiva.com/46445/444357-46445703.pdf?src-supplier=Element14; ComponentLink1Description: https://datasheet.ciiva.com/46445/444357-46445703.pdf?src-supplier=Element14; ComponentLink2URL: https://datasheet.ciiva.com/7857/1692832-7857244.pdf?src-supplier=Element14; ComponentLink2Description: https://datasheet.ciiva.com/7857/1692832-7857244.pdf?src-supplier=Element14; ComponentLink3URL: https://datasheet.ciiva.com/7857/1692832-7857245.pdf?src-supplier=Element14; ComponentLink3Description: https://datasheet.ciiva.com/7857/1692832-7857245.pdf?src-supplier=Element14; Supplier Part Number 1: RC1206FR-0710KL
R2 = RC1206FR-07100RL: Res General Purpose Thick Film 1206 100 Ohm 1% 1/4W ±100ppm/°C Molded SMD Paper T/R; Manufacturer: Yageo; Power Rating: 250mW; Voltage Rating: 200V; Supplier 1: Arrow Electronics; Manufacturer Part Number: RC1206FR-07100RL; RoHS: Yes; Category: Chip SMD Resistors; Stock 1: 15950000; Pricing 1: 5000=0.00540, 10000=0.00450 (USD); Case/Package: 1206; Case Code (Imperial): 1206; Case Code (Metric): 3216; Size Code: 1206; Min Operating Temperature: -55°C; Max Operating Temperature: 155°C; Tolerance: 1%; Packaging: Tape and Reel; Resistance: 100R; Package Quantity: 5000; Termination: SMD/SMT; Resistor Type: Thick Film; Temperature Coefficient: 100ppm/°C; Features: Moisture Resistant; Series: RC; Max Power Dissipation: 250mW; Number of Terminations: 2; Resistance Tolerance: 1%; Technology: THICK FILM; Length: 3.1mm; Width: 1.6mm; Height: 0.55mm; Depth: 1.6mm; REACH SVHC: Unknown; Lead Free: Lead Free; RoHS Compliant: Yes; ComponentLink1URL: https://datasheet.ciiva.com/11808/0900766b80c6630a-11808606.pdf?src-supplier=RSComponents; ComponentLink1Description: https://datasheet.ciiva.com/11808/0900766b80c6630a-11808606.pdf?src-supplier=RSComponents; ComponentLink2URL: https://datasheet.ciiva.com/46445/444357-46445702.pdf?src-supplier=Element14; ComponentLink2Description: https://datasheet.ciiva.com/46445/444357-46445702.pdf?src-supplier=Element14; ComponentLink3URL: https://datasheet.ciiva.com/7857/444357-7857241.pdf?src-supplier=Element14; ComponentLink3Description: https://datasheet.ciiva.com/7857/444357-7857241.pdf?src-supplier=Element14; ComponentLink4URL: https://datasheet.ciiva.com/7857/444357-7857242.pdf?src-supplier=Element14; ComponentLink4Description: https://datasheet.ciiva.com/7857/444357-7857242.pdf?src-supplier=Element14; Supplier Part Number 1: RC1206FR-07100RL
R3 = RC1206FR-071KL: In a Pack of 5000, 1K 1206 Thick Film SMD Resistor ±1% 0.25W - RC1206FR-071KL; Manufacturer: Yageo; Resistance: 1kR; Power Rating: 250mW; Voltage Rating: 200V; Temperature Coefficient: 100ppm/°C; Supplier 1: Arrow Electronics; Manufacturer Part Number: RC1206FR-071KL; RoHS: Yes; Category: Chip SMD Resistors; Stock 1: 535000; Pricing 1: 5000=0.00940, 10000=0.00890 (USD); Case/Package: 1206; Case Code (Imperial): 1206; Case Code (Metric): 3216; Size Code: 1206; Min Operating Temperature: -55°C; Max Operating Temperature: 155°C; Tolerance: 1%; Packaging: Tape and Reel; Resistor Type: Thick Film; Termination: SMD/SMT; Series: RC; Resistance Tolerance: 1%; Construction: Rectangular; Technology: THICK FILM; Length: 3.1mm; Height: 0.55mm; Depth: 1.6mm; REACH SVHC: Unknown; Military Standard: Not; Lead Free: Lead Free; RoHS Compliant: Yes; ComponentLink1URL: https://datasheet.ciiva.com/11808/0900766b80c6630a-11808217.pdf?src-supplier=RSComponents; ComponentLink1Description: https://datasheet.ciiva.com/11808/0900766b80c6630a-11808217.pdf?src-supplier=RSComponents; ComponentLink2URL: https://datasheet.ciiva.com/29181/402540-da-01-en-smd-widerstand-chip1206-1-kohm-29181462.pdf?src-supplier=Conrad; ComponentLink2Description: https://datasheet.ciiva.com/29181/402540-da-01-en-smd-widerstand-chip1206-1-kohm-29181462.pdf?src-supplier=Conrad; ComponentLink3URL: https://datasheet.ciiva.com/46445/444357-46445708.pdf?src-supplier=Element14; ComponentLink3Description: https://datasheet.ciiva.com/46445/444357-46445708.pdf?src-supplier=Element14; Supplier Part Number 1: RC1206FR-071KL
R6 = RC1206FR-071ML: Res Thick Film 1206 1M Ohm 1% 0.25W(1/4W) ±100ppm/°C Epoxy Pad SMD T/R; Manufacturer: Yageo; Resistance: 1MR; Power Rating: 250mW; Voltage Rating: 200V; Supplier 1: Arrow Electronics; Manufacturer Part Number: RC1206FR-071ML; RoHS: Yes; Category: Chip SMD Resistors; Stock 1: 90000; Pricing 1: 5000=0.01560, 10000=0.01040, 25000=0.01030 (USD); Case/Package: 1206; Case Code (Imperial): 1206; Case Code (Metric): 3216; Size Code: 1206; Min Operating Temperature: -55°C; Max Operating Temperature: 155°C; Tolerance: 1%; Packaging: Tape and Reel; Temperature Coefficient: 100ppm/°C; Resistor Type: Thick Film; Package Quantity: 5000; Termination: SMD/SMT; Features: Moisture Resistant; Series: RC; Max Power Dissipation: 250mW; Number of Terminations: 2; Technology: THICK FILM; Resistance Tolerance: 1%; Construction: Rectangular; Length: 3.1mm; Width: 1.6mm; Height: 0.55mm; Depth: 1.6mm; REACH SVHC: Unknown; Lead Free: Lead Free; Military Standard: Not; RoHS Compliant: Yes; ComponentLink1URL: https://datasheet.ciiva.com/11819/0900766b80c6630a-11819912.pdf?src-supplier=RSComponents; ComponentLink1Description: https://datasheet.ciiva.com/11819/0900766b80c6630a-11819912.pdf?src-supplier=RSComponents; ComponentLink2URL: https://datasheet.ciiva.com/46445/444357-46445709.pdf?src-supplier=Element14; ComponentLink2Description: https://datasheet.ciiva.com/46445/444357-46445709.pdf?src-supplier=Element14; ComponentLink3URL: https://datasheet.ciiva.com/7857/444357-7857289.pdf?src-supplier=Element14; ComponentLink3Description: https://datasheet.ciiva.com/7857/444357-7857289.pdf?src-supplier=Element14; ComponentLink4URL: https://datasheet.ciiva.com/7857/444357-7857288.pdf?src-supplier=Element14; ComponentLink4Description: https://datasheet.ciiva.com/7857/444357-7857288.pdf?src-supplier=Element14; ComponentLink5URL: https://datasheet.ciiva.com/17033/pyu-rc1206-51-rohs-l-4-17033611.pdf?src-supplier=Future+Electronics; ComponentLink5Description: https://datasheet.ciiva.com/17033/pyu-rc1206-51-rohs-l-4-17033611.pdf?src-supplier=Future+Electronics; Supplier Part Number 1: RC1206FR-071ML
SW1-SW3 = PTS526SKG15SMTR2LFS: Switch Tactile N.O. SPST Round Button Gull Wing 0.05A 12VDC 200000Cycles 2.45N SMD T/R; Manufacturer: ITT C&K; Supplier 1: Digi-Key; Manufacturer Part Number: PTS526SKG15SMTR2LFS; RoHS: No; Category: Tactile Switches; Stock 1: 7554; Pricing 1: 1=0.13000, 10=0.12100, 25=0.11480, 100=0.10430, 250=0.09808, 500=0.08972, 1000=0.07511 (USD); Supplier Part Number 1: CKN12223-1-ND
U1 = STM32F407ZET6: No Description Available; Mfr_Name: STMicroelectronics; Copyright: Copyright (C) 2022 Ultra Librarian. All rights reserved.; Manufacturer_Part_Number: STM32F407ZET6; RefDes: RefDes; Type: DEV
U24 = DIO7553ST6: USB Power Switch
Y1 = CRYSTAL 8.000MHZ: CRYSTAL 8.000MHZ 20PF THRU; Manufacturer: TXC; Manufacturer Part Number: 9B-8.000MBBK-B; Frequency Stability: 50ppm; Frequency: 8MHz; ESR (Equivalent Series Resistance): 80R; Supplier 1: Digi-Key; RoHS: Yes; Category: Crystals; Pricing 1: 1000=0.16000 (USD); Mount: Through Hole; Case/Package: Metal; Min Operating Temperature: -20°C; Max Operating Temperature: 70°C; Package Quantity: 1000; Frequency Tolerance: 50ppm; Load Capacitance: 20pF; Packaging: Bulk; Length: 0.453inch; Width: 0.197inch; Height: 0.145inch; ComponentLink1URL: https://datasheet.ciiva.com/6733/9b-6733750.pdf?src-supplier=Digi-Key; ComponentLink1Description: https://datasheet.ciiva.com/6733/9b-6733750.pdf?src-supplier=Digi-Key; ComponentLink2URL: https://datasheet.ciiva.com/29631/9b-29631174.pdf?src-supplier=Digi-Key; ComponentLink2Description: https://datasheet.ciiva.com/29631/9b-29631174.pdf?src-supplier=Digi-Key; Supplier Part Number 1: 887-2033-ND

## Sheet rs485.SchDoc
size A2; SheetNumber: 8; SheetTotal: 9
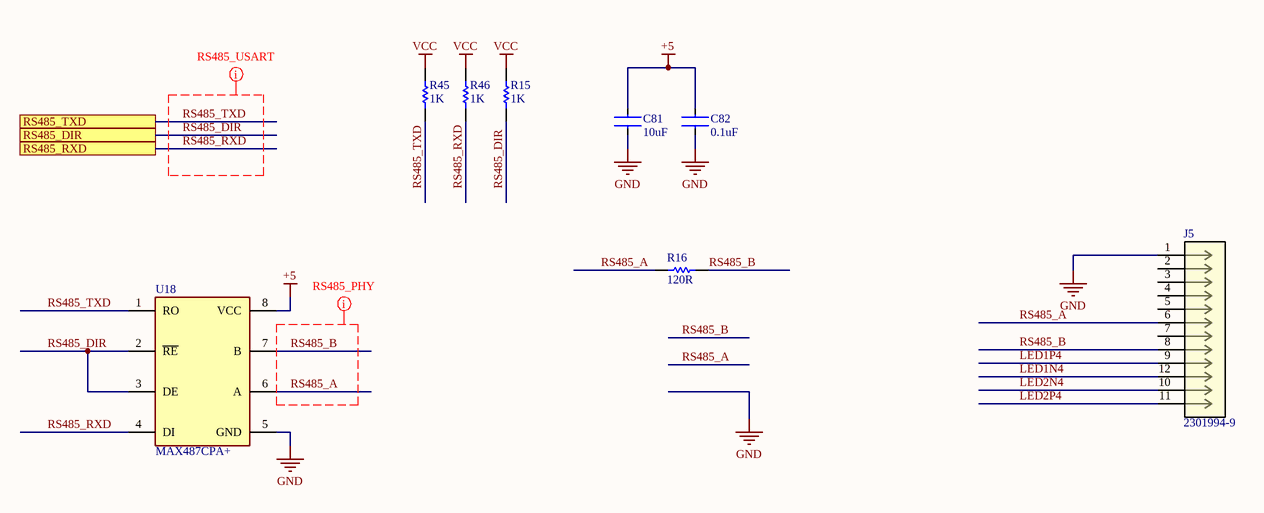
[diagram p4: rs485.SchDoc]

### Parts
C81  10uF  [C0402]
C82  0.1uF  [C0402]
J5  2301994-9  [CONN12_2301994-9_TEC]
R15  1K  [R0402]
R16  120R  [R0402]
R45  1K  [R0402]
R46  1K  [R0402]
U18  MAX487CPA+  [SOIC-8]

### Ports
RS485_DIR, RS485_RXD, RS485_TXD

### Nets
+5: C81.1 C82.1 U18.8(VCC)
GND: C81.2 C82.2 J5.1 U18.5(GND)
VCC: R15.2 R45.2 R46.2
LED1N4: J5.12
LED1P4: J5.9
LED2N4: J5.10
LED2P4: J5.11
RS485_A: J5.6 R16.1 U18.6(A)
RS485_B: J5.8 R16.2 U18.7(B)
RS485_DIR: R15.1 U18.2(~{RE}) U18.3(DE) ; port RS485_DIR  [project net DIR]
RS485_RXD: R46.1 U18.4(DI) ; port RS485_RXD
RS485_TXD: R45.1 U18.1(RO) ; port RS485_TXD

Not connected (* = marked no-connect by the designer): J5 2 3 4 5 7

### Layout directives
mark named RS485_PHY: RS485_A, RS485_B
mark named RS485_USART: RS485_DIR, RS485_RXD, RS485_TXD

### Notes on the sheet
- CONFIDENTAL. Do not distribute.
- Page Contents:
- Title:
- Company
- Logo
- Date:
- SIZE:
- A2
- DWG Num:
- Time:
- Variant:
- Sheet
- Revision:
- of
- Drawn by:
- Checked by:

### Library data of the parts
C81 = CL31B106KOHNNNE: as C5 on sheet rgb_card; Supplier 1: Future Electronics; Manufacturer Part Number: CL31B106KOHNNNE; RoHS: Yes; Category: Ceramic Capacitors; Stock 1: 116000; Pricing 1: 2000=0.03800, 6000=0.03460, 8000=0.03450, 20000=0.03420, 30000=0.03400 (USD); Mount: Surface Mount; Case/Package: 1206; Case Code (Metric): 3216; Case Code (Imperial): 1206; Material: Ceramic; Contact Plating: Tin; Min Operating Temperature: -55°C; Max Operating Temperature: 125°C; Capacitance: 10uF; Tolerance: 10%; Dielectric: X7R; Package Quantity: 1; Packaging: Tape and Reel; Voltage Rating: 16V; Series: CL; Length: 3.2mm; Width: 0.063inch; Height: 1.6mm; Thickness: 0.071inch; Depth: 1.6mm; RoHS Compliant: Yes; ComponentLink1URL: https://datasheet.ciiva.com/25795/cl31b106kohnnne-25795201.pdf?src-supplier=Digi-Key; ComponentLink1Description: https://datasheet.ciiva.com/25795/cl31b106kohnnne-25795201.pdf?src-supplier=Digi-Key; ComponentLink2URL: https://datasheet.ciiva.com/29201/452535-da-01-en-vs-kondensator-1206-29201132.pdf?src-supplier=Conrad; ComponentLink2Description: https://datasheet.ciiva.com/29201/452535-da-01-en-vs-kondensator-1206-29201132.pdf?src-supplier=Conrad; Supplier Part Number 1: 2558872
C82 = CL31B104KBCNNNC: as C3 on sheet rgb_card; Supplier 1: Arrow Electronics; Manufacturer: Samsung; Manufacturer Part Number: CL31B104KBCNNNC; RoHS: Yes; Category: Ceramic Capacitors; Stock 1: 3508000; Pricing 1: 4000=0.02060, 8000=0.01660 (USD); Mount: Surface Mount; Case/Package: 1206; Case Code (Metric): 3216; Case Code (Imperial): 1206; Material: Ceramic; Contact Plating: Tin; Min Operating Temperature: -55°C; Max Operating Temperature: 125°C; Capacitance: 100nF; Voltage Rating (DC): 50V; Packaging: Tape and Reel; Voltage Rating: 50V; Series: CL; Length: 3.2mm; Width: 0.063inch; Height: 0.85mm; Depth: 1.6mm; Thickness: 0.037inch; Radiation Hardening: No; Lead Free: Lead Free; RoHS Compliant: Yes; ComponentLink1URL: https://datasheet.ciiva.com/25710/cl31b104kbcnnnc-25710293.pdf?src-supplier=Digi-Key; ComponentLink1Description: https://datasheet.ciiva.com/25710/cl31b104kbcnnnc-25710293.pdf?src-supplier=Digi-Key; ComponentLink2URL: https://datasheet.ciiva.com/29201/451941-da-01-en-vs-kondensator-1206-29201689.pdf?src-supplier=Conrad; ComponentLink2Description: https://datasheet.ciiva.com/29201/451941-da-01-en-vs-kondensator-1206-29201689.pdf?src-supplier=Conrad; ComponentLink3URL: https://datasheet.ciiva.com/16298/cl05b104kq5nnnc-16298186.pdf?src-supplier=Future+Electronics; ComponentLink3Description: https://datasheet.ciiva.com/16298/cl05b104kq5nnnc-16298186.pdf?src-supplier=Future+Electronics; Supplier Part Number 1: CL31B104KBCNNNC
J5 = 2301994-9: No Description Available; Mfr_Name: TE Connectivity; Copyright: Copyright (C) 2022 Ultra Librarian. All rights reserved.; Manufacturer_Part_Number: 2301994-9; RefDes: RefDes; Type: DEV
R15 R45 R46 = RC1206FR-071KL: as R3 on sheet rgb_card; Supplier 1: Arrow Electronics; Manufacturer Part Number: RC1206FR-071KL; RoHS: Yes; Category: Chip SMD Resistors; Stock 1: 535000; Pricing 1: 5000=0.00940, 10000=0.00890 (USD); Case/Package: 1206; Case Code (Imperial): 1206; Case Code (Metric): 3216; Size Code: 1206; Min Operating Temperature: -55°C; Max Operating Temperature: 155°C; Tolerance: 1%; Packaging: Tape and Reel; Resistor Type: Thick Film; Termination: SMD/SMT; Series: RC; Resistance Tolerance: 1%; Construction: Rectangular; Technology: THICK FILM; Length: 3.1mm; Height: 0.55mm; Depth: 1.6mm; REACH SVHC: Unknown; Military Standard: Not; Lead Free: Lead Free; RoHS Compliant: Yes; ComponentLink1URL: https://datasheet.ciiva.com/11808/0900766b80c6630a-11808217.pdf?src-supplier=RSComponents; ComponentLink1Description: https://datasheet.ciiva.com/11808/0900766b80c6630a-11808217.pdf?src-supplier=RSComponents; ComponentLink2URL: https://datasheet.ciiva.com/29181/402540-da-01-en-smd-widerstand-chip1206-1-kohm-29181462.pdf?src-supplier=Conrad; ComponentLink2Description: https://datasheet.ciiva.com/29181/402540-da-01-en-smd-widerstand-chip1206-1-kohm-29181462.pdf?src-supplier=Conrad; ComponentLink3URL: https://datasheet.ciiva.com/46445/444357-46445708.pdf?src-supplier=Element14; ComponentLink3Description: https://datasheet.ciiva.com/46445/444357-46445708.pdf?src-supplier=Element14; Supplier Part Number 1: RC1206FR-071KL
R16 = RC1206FR-07120RL: Res Thick Film 1206 120 Ohm 1% 0.25W(1/4W) ±100ppm/°C Pad SMD T/R; Manufacturer: Yageo; Power Rating: 250mW; Voltage Rating: 200V; Supplier 1: Arrow Electronics; Manufacturer Part Number: RC1206FR-07120RL; RoHS: Yes; Category: Chip SMD Resistors; Stock 1: 1086; Pricing 1: 1=0.07410, 10=0.04680, 25=0.03250, 100=0.02110, 250=0.02080, 500=0.02000, 1000=0.01370 (USD); Case/Package: 1206; Case Code (Imperial): 1206; Case Code (Metric): 3216; Size Code: 1206; Min Operating Temperature: -55°C; Max Operating Temperature: 155°C; Resistance: 120R; Tolerance: 1%; Packaging: Tape and Reel; Resistor Type: Thick Film; Temperature Coefficient: 100ppm/°C; Package Quantity: 5000; Termination: SMD/SMT; Features: Moisture Resistant; Series: RC; Max Power Dissipation: 250mW; Number of Terminations: 2; Resistance Tolerance: 1%; Technology: THICK FILM; Length: 3.1mm; Width: 1.6mm; Height: 0.55mm; Depth: 1.6mm; REACH SVHC: Unknown; Lead Free: Lead Free; RoHS Compliant: Yes; ComponentLink1URL: https://datasheet.ciiva.com/11819/0900766b80c6630a-11819893.pdf?src-supplier=RSComponents; ComponentLink1Description: https://datasheet.ciiva.com/11819/0900766b80c6630a-11819893.pdf?src-supplier=RSComponents; ComponentLink2URL: https://datasheet.ciiva.com/7857/444357-7857253.pdf?src-supplier=Element14; ComponentLink2Description: https://datasheet.ciiva.com/7857/444357-7857253.pdf?src-supplier=Element14; ComponentLink3URL: https://datasheet.ciiva.com/16746/pyu-rc1206-51-rohs-l-4-16746171.pdf?src-supplier=Future+Electronics; ComponentLink3Description: https://datasheet.ciiva.com/16746/pyu-rc1206-51-rohs-l-4-16746171.pdf?src-supplier=Future+Electronics; Supplier Part Number 1: RC1206FR-07120RL
U18 = MAX487ECPA+: Interface IC RS422/485 DIL-8, MAX487ECPA+, Maxim; Operating Supply Voltage: 5V; Number of Transmitters: 1; Logic Function: Transceiver; Data Rate: 256Kbps; Max Power Dissipation: 727mW; Output Voltage: 3V; Propagation Delay: 250ns; Max Supply Voltage: 5.25V; Min Supply Voltage: 4.75V; Nominal Supply Current: 250uA; Interface: RS-422,RS-485; Simplex/Duplex: Half Duplex; Supplier 1: Digi-Key; Manufacturer: Maxim; Manufacturer Part Number: MAX487ECPA+; RoHS: Yes; Category: Interface ICs; Stock 1: 285; Pricing 1: 1=4.05000, 10=3.63500, 25=3.43680, 100=3.05500 (USD); Mount: Through Hole; Case/Package: DIP; Number of Pins: 8; Min Operating Temperature: 0°C; Max Operating Temperature: 70°C; Packaging: Rail/Tube; Package Quantity: 50; Number of Receivers: 1; Number of Transceivers: 1; Series: -; Number of Drivers: 1; Supply Current: 250uA; Length: 9.91mm; Width: 7.87mm; Height: 4.45mm; Radiation Hardening: No; Lead Free: Lead Free; RoHS Compliant: Yes; REACH SVHC: No SVHC; ComponentLink1URL: https://datasheet.ciiva.com/16973/0900766b8078aed8-16973392.pdf?src-supplier=Allied+Electronics; ComponentLink1Description: https://datasheet.ciiva.com/16973/0900766b8078aed8-16973392.pdf?src-supplier=Allied+Electronics; ComponentLink2URL: https://datasheet.ciiva.com/16640/max1487e-max491e-16640614.pdf?src-supplier=Avnet+Europe; ComponentLink2Description: https://datasheet.ciiva.com/16640/max1487e-max491e-16640614.pdf?src-supplier=Avnet+Europe; ComponentLink3URL: https://datasheet.ciiva.com/8075/3976-8075401.pdf?src-supplier=Element14; ComponentLink3Description: https://datasheet.ciiva.com/8075/3976-8075401.pdf?src-supplier=Element14; ComponentLink4URL: https://datasheet.ciiva.com/14430/max1487e-max491e-14430329.pdf?src-supplier=Avnet; ComponentLink4Description: https://datasheet.ciiva.com/14430/max1487e-max491e-14430329.pdf?src-supplier=Avnet; ComponentLink5URL: https://datasheet.ciiva.com/14152/jxmax481e-491e-e-14152719.pdf?src-supplier=Distrelec; ComponentLink5Description: https://datasheet.ciiva.com/14152/jxmax481e-491e-e-14152719.pdf?src-supplier=Distrelec; ComponentLink6URL: https://datasheet.ciiva.com/1713/max1487e-max491e-1713146.pdf?src-supplier=Digi-Key; ComponentLink6Description: https://datasheet.ciiva.com/1713/max1487e-max491e-1713146.pdf?src-supplier=Digi-Key; ComponentLink7URL: https://datasheet.ciiva.com/4785/max1487e-max491e-4785914.pdf?src-supplier=Mouser; ComponentLink7Description: https://datasheet.ciiva.com/4785/max1487e-max491e-4785914.pdf?src-supplier=Mouser; Supplier Part Number 1: MAX487ECPA+-ND